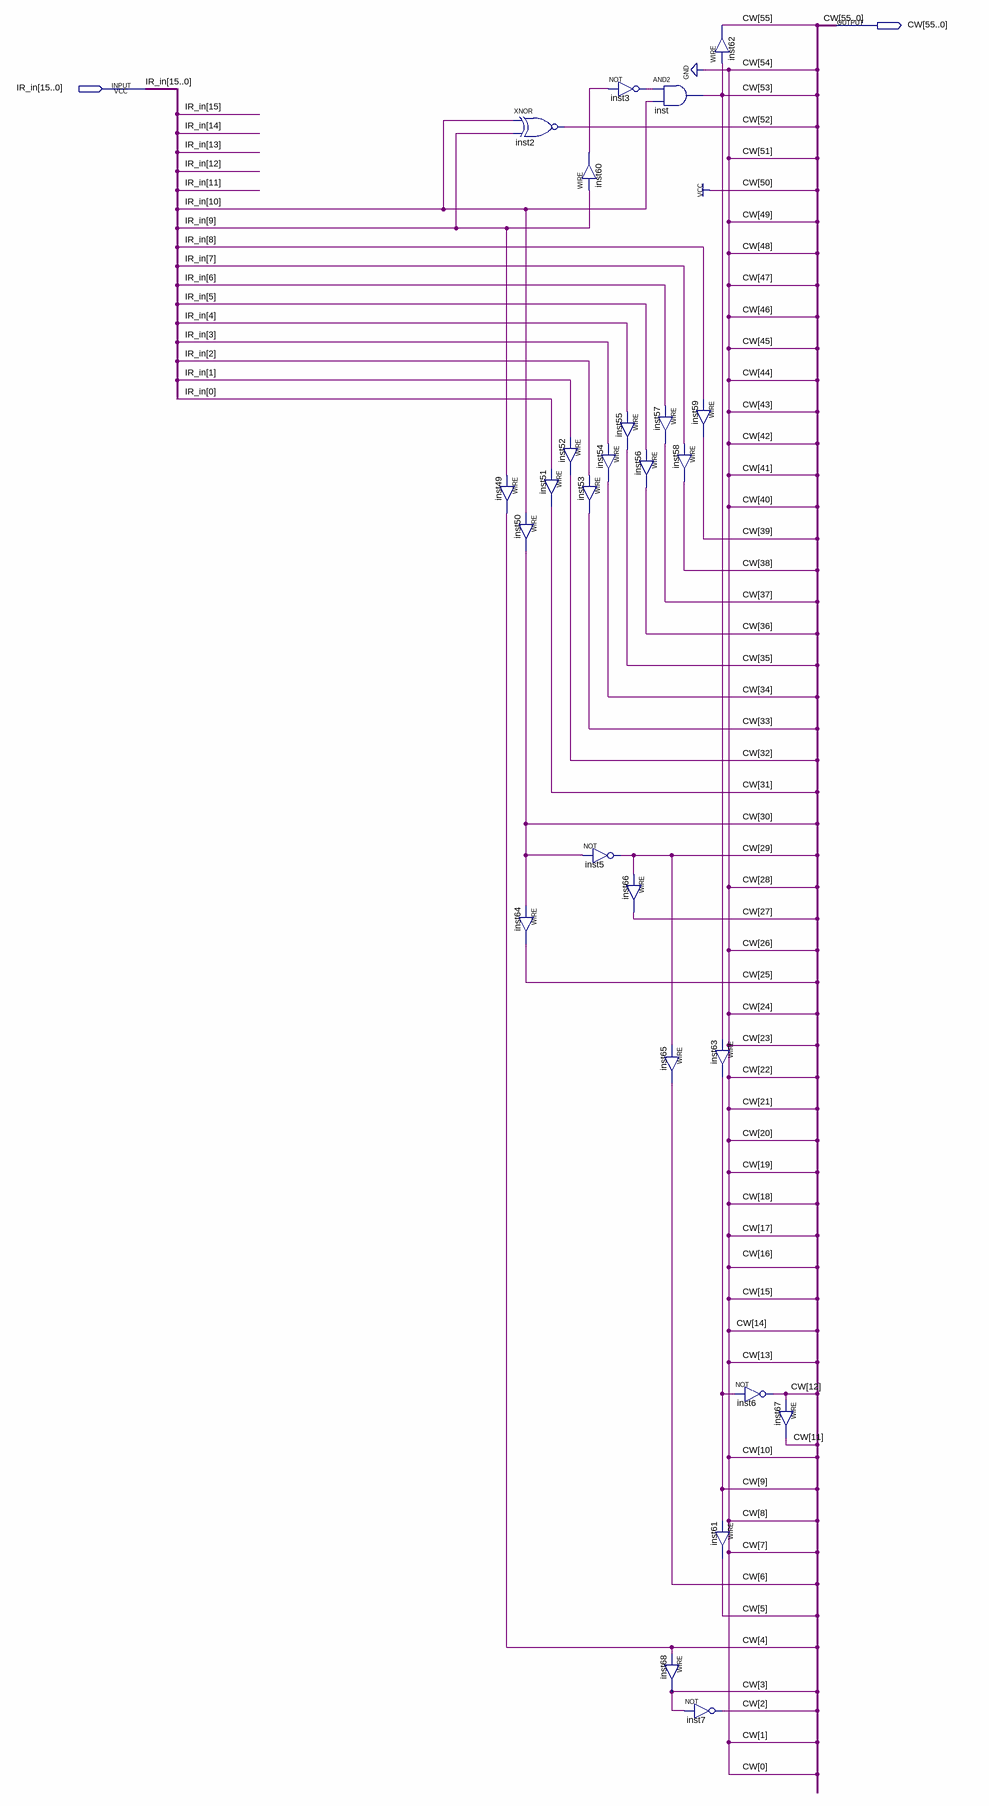
[diagram p0: schematic sheet]
// Quartus schematic Execute0_10_PC.bdf as structural Verilog: 26 symbols, 2 pins
module Execute0_10_PC (
  input  [15:0] IR_in,
  output [55:0] CW
);

  wire inst3_out, inst60_out;

  assign CW[4] = IR_in[9];  // WIRE inst49
  xnor inst2 (CW[52], IR_in[10], IR_in[9]);
  assign CW[31] = IR_in[0];  // WIRE inst51
  assign CW[30] = IR_in[10];  // WIRE inst50
  assign CW[25] = CW[30];  // WIRE inst64
  assign inst60_out = IR_in[9];  // WIRE inst60
  assign CW[32] = IR_in[1];  // WIRE inst52
  assign CW[34] = IR_in[3];  // WIRE inst54
  assign CW[33] = IR_in[2];  // WIRE inst53
  not inst5 (CW[29], CW[30]);
  not inst3 (inst3_out, inst60_out);
  assign CW[35] = IR_in[4];  // WIRE inst55
  assign CW[36] = IR_in[5];  // WIRE inst56
  assign CW[27] = CW[29];  // WIRE inst66
  and inst (CW[53], inst3_out, IR_in[10]);
  assign CW[39] = IR_in[8];  // WIRE inst59
  assign CW[37] = IR_in[6];  // WIRE inst57
  assign CW[38] = IR_in[7];  // WIRE inst58
  assign CW[6] = CW[29];  // WIRE inst65
  assign CW[3] = CW[4];  // WIRE inst68
  not inst7 (CW[2], CW[3]);
  assign CW[55] = CW[53];  // WIRE inst62
  assign CW[9] = CW[53];  // WIRE inst63
  not inst6 (CW[12], CW[9]);
  assign CW[5] = CW[9];  // WIRE inst61
  assign CW[11] = CW[12];  // WIRE inst67

  assign {CW[54], CW[51:40], CW[28], CW[26], CW[24:13], CW[10], CW[8:7], CW[1:0]} = 32'b00100000000000000000000000000000;
endmodule
